# Altium schematic sheet Extensibilite.SchDoc: EXTENSIBILITE
size A4; Date: 28/11/2024; Author: NOUBIGA Thierry; SheetNumber: 3; SheetTotal: 7; Time: 14h33
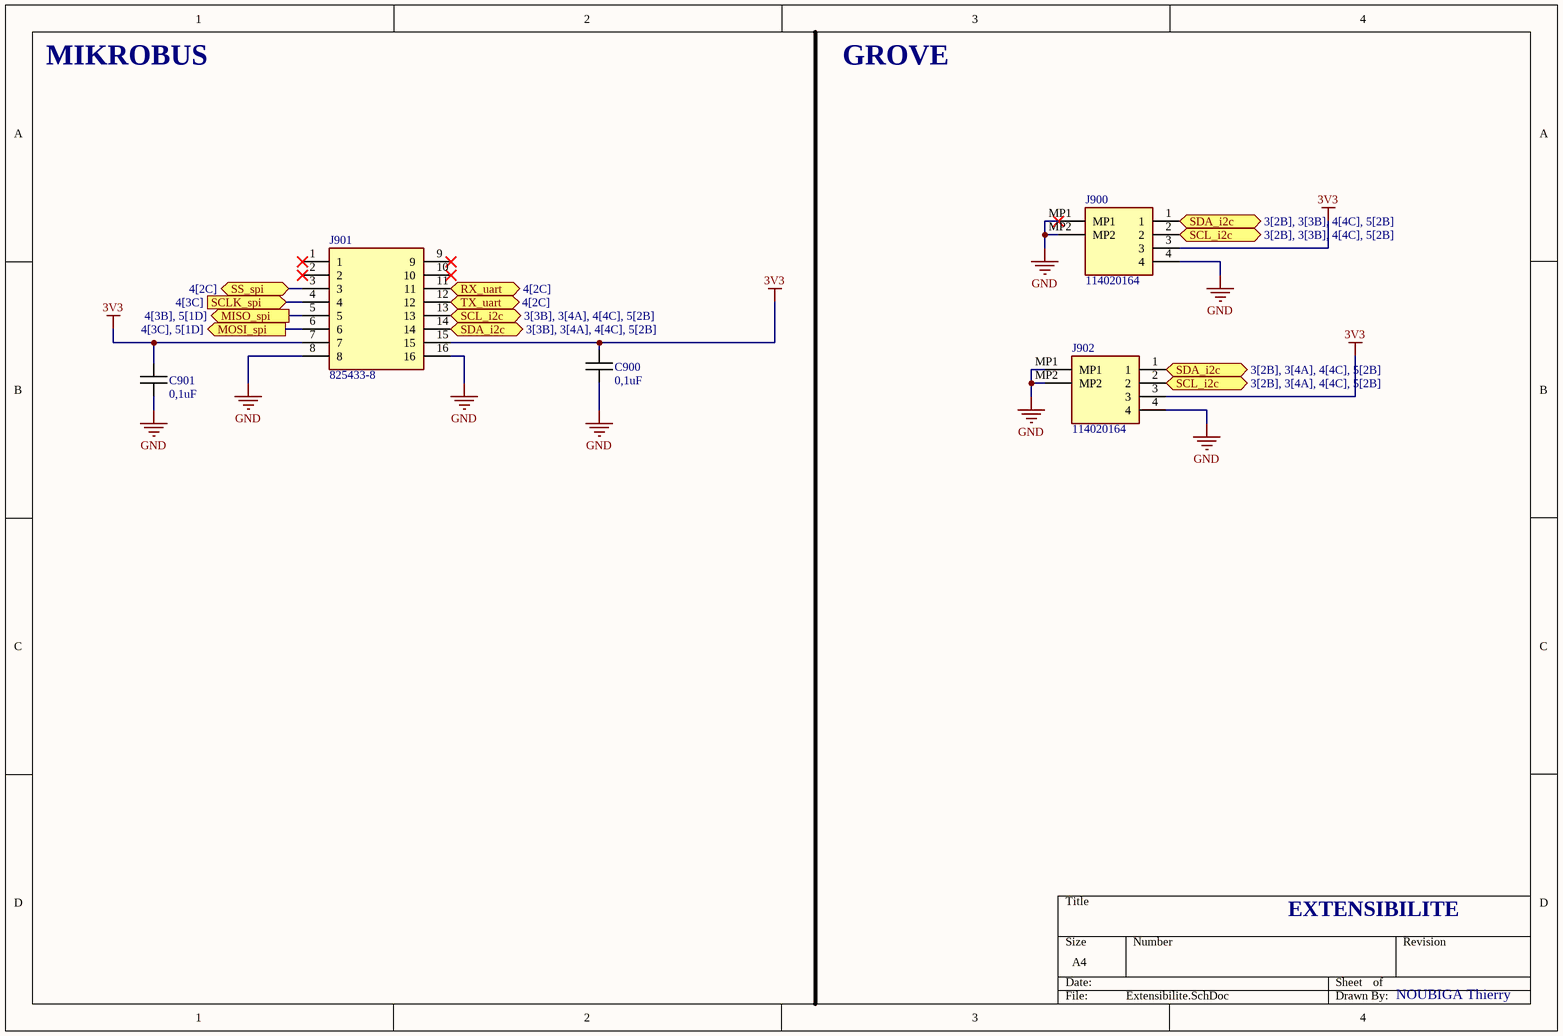
[diagram p0: Extensibilite.SchDoc]

## Parts
C900  0,1uF  [CAPC1005X06N]
C901  0,1uF  [CAPC1005X06N]
J900  114020164  [114020164]
J901  825433-8  [Connect-Mikronus]
J902  114020164  [114020164]

## Ports
MISO_spi (out, see 4[3B], 5[1D]), MOSI_spi (out, see 4[3C], 5[1D]), RX_uart (bidir, see 4[2C]), SCL_i2c (bidir, see 3[2B], 3[3B], 4[4C], 5[2B]), SCL_i2c (bidir, see 3[2B], 3[4A], 4[4C], 5[2B]), SCL_i2c (bidir, see 3[3B], 3[4A], 4[4C], 5[2B]), SCLK_spi (in, see 4[3C]), SDA_i2c (bidir, see 3[2B], 3[3B], 4[4C], 5[2B]), SDA_i2c (bidir, see 3[2B], 3[4A], 4[4C], 5[2B]), SDA_i2c (bidir, see 3[3B], 3[4A], 4[4C], 5[2B]), SS_spi (bidir, see 4[2C]), TX_uart (bidir, see 4[2C])

## Nets
3V3: C900.1 C901.1 J900.3 J901.7 J901.15 J902.3
GND: C900.2 C901.2 J900.4 J900.MP1 J900.MP2 J901.8 J901.16 J902.4 J902.MP1 J902.MP2
MISO_spi: J901.5 ; port MISO_spi
MOSI_spi: J901.6 ; port MOSI_spi
RX_uart: J901.11 ; port RX_uart
SCL_i2c: J900.2 J901.13 J902.2 ; port SCL_i2c
SCLK_spi: J901.4 ; port SCLK_spi
SDA_i2c: J900.1 J901.14 J902.1 ; port SDA_i2c
SS_spi: J901.3 ; port SS_spi
TX_uart: J901.12 ; port TX_uart

Not connected (* = marked no-connect by the designer): J901 1* 2* 9* 10*

## Notes on the sheet
- MIKROBUS
- GROVE
- EXTENSIBILITE
- NOUBIGA Thierry

## Library data of the parts
C900 C901 = Capacitor
J900 J902 = 114020164: Seeed Studio Accessories Grove Female Header - SMD-4P-2.0mm-90D-20Pcs; Manufacturer_Name: Seeed Studio; Manufacturer_Part_Number: 114020164; Mouser Part Number: 713-114020164
J901 = Connect-Mikronus: Headers & Wire Housings 8P double for connection mikrobus; Manufacturer_Name: TE Connectivity; Manufacturer_Part_Number: 825433-8; Mouser Part Number: 571-825433-8